# Altium schematic sheet MotherboardSupply.SchDoc: IMEBUILD V2 BP
size A4; Organization: Lightwave Lab; Address1: Princeton University; Address2: Princeton NJ 08544; Address3: United States; DocumentNumber: 3; Revision: B; SheetNumber: 3; SheetTotal: 3
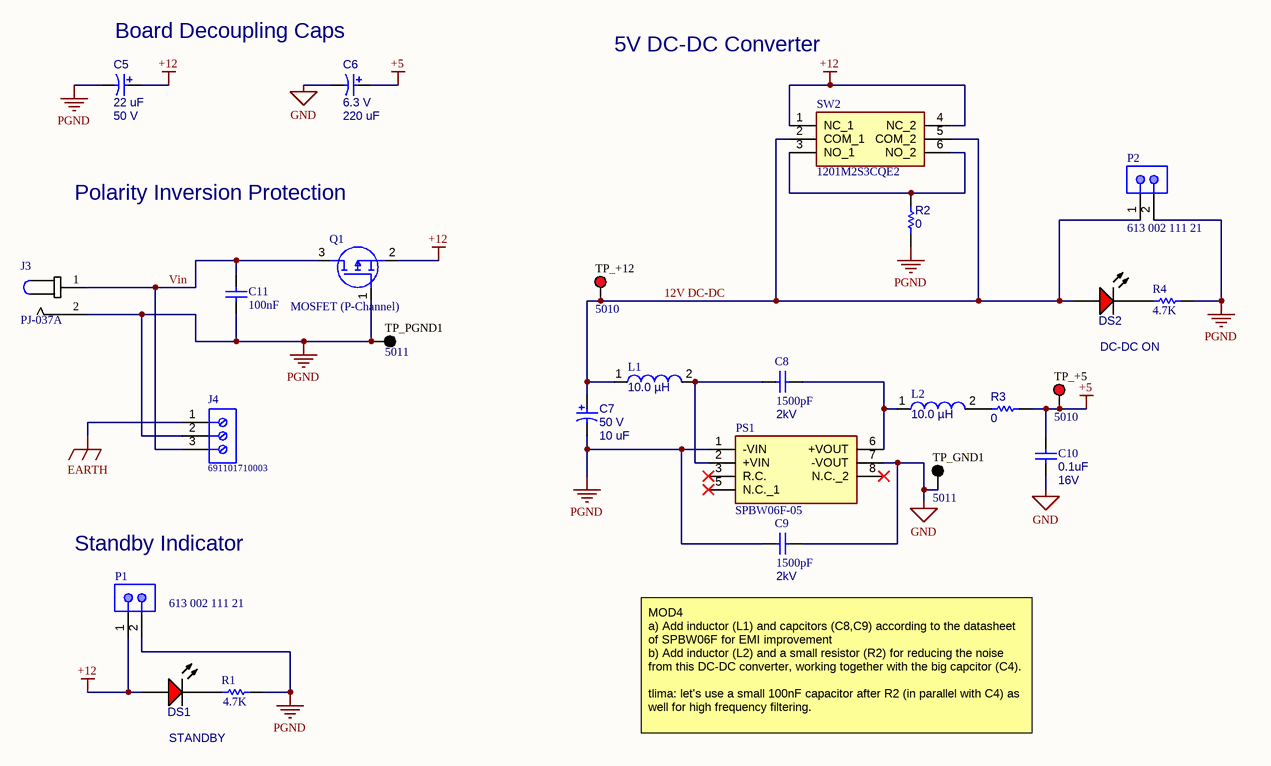
[diagram p0: MotherboardSupply.SchDoc]

## Parts
C5  Rated Capacitance: 22 uF  Rated Voltage: 50 V  [NIC-CAPA2-6.3X5.8_V]  (hidden comment: UUD1H220MCL1GS)
C6  Rated Voltage: 6.3 V  Rated Capacitance: 220 uF  [NIC-CAPA2-6.3X5.8_V]  (hidden comment: UUD0J221MCL1GS)
C7  Rated Voltage: 50 V  Rated Capacitance: 10 uF  [NIC-CAPA2-6.3X5.8_V]  (hidden comment: UUD0J221MCL1GS)
C8  value 1500pF  Rated Voltage: 2kV  [C1206]  (hidden comment: CC1206KKX7RDBB152)
C9  value 1500pF  Rated Voltage: 2kV  [C1206]  (hidden comment: CC1206KKX7RDBB152)
C10  value 0.1uF  Rated Voltage: 16V  [CAPC1608X87X35LL15T15]  (hidden comment: C0603C104K4RACTU)
C11  100nF  [CAPC1206(3216)150_M]
DS1  TLMS1000-GS08  [VISH-TLMS1000_V]  (value not drawn)
DS2  TLMS1000-GS08  [VISH-TLMS1000_V]  (value not drawn)
J3  PJ-037A  [*CUI_PJ-037A]
J4  691101710003  [691101710003]
L1  Inductance: 10.0 µH  [WE-PD-L]  (hidden comment: 74477110)
L2  Inductance: 10.0 µH  [WE-PD-L]  (hidden comment: 74477110)
P1  613 002 111 21  [WE-61300211121_V]
P2  613 002 111 21  [WE-61300211121_V]
PS1  SPBW06F-05  [SPBW06F05]
Q1  MOSFET (P-Channel)  [FFSB20120AF085]
R1  4.7K  [RESC3216X60X45ML10T20]
R2  0  [RESC3216X105X45ML10T20]
R3  0  [RESC3216X105X45ML10T20]
R4  4.7K  [RESC3216X60X45ML10T20]
SW2  1201M2S3CQE2  [1201M2S3CQE2]
TP_+5  5010  [KSTN-5010_V]
TP_+12  5010  [KSTN-5010_V]
TP_GND1  5011  [KSTN-5011_V]
TP_PGND1  5011  [KSTN-5011_V]

## Nets
+5: C6.1 C10.2 R3.2 TP_+5.1
+12: C5.1 DS1.1(A) P1.1 Q1.2(S) SW2.1(NC_1) SW2.4(NC_2)
EARTH: J4.1
GND: C6.2 C9.2 C10.1 PS1.7(-VOUT) TP_GND1.1
PGND: C5.2 C7.2 C9.1 C11.2 J3.2 J4.2 P1.2 P2.2 PS1.1(-VIN) Q1.1(G) R1.2 R2.2 R4.1 TP_PGND1.1
12V DC-DC: C7.1 DS2.1(A) L1.1 P2.1 SW2.2(COM_1) SW2.5(COM_2) TP_+12.1
Vin: C11.1 J3.1 J4.3 Q1.3(D)
NetC8_1: C8.1 L1.2 PS1.2(+VIN)
NetC8_2: C8.2 L2.1 PS1.6(+VOUT)
NetDS1_2: DS1.2(K) R1.1
NetDS2_2: DS2.2(K) R4.2
NetL2_2: L2.2 R3.1
NetR2_1: R2.1 SW2.3(NO_1) SW2.6(NO_2)

Not connected (* = marked no-connect by the designer): PS1 3(R.C.)* 5(N.C._1)* 8(N.C._2)*

## Notes on the sheet
- Board Decoupling Caps
- 5V DC-DC Converter
- Polarity Inversion Protection
- DC-DC ON
- Standby Indicator
- STANDBY
- MOD4
  a) Add inductor (L1) and capcitors (C8,C9) according to the datasheet of SPBW06F for EMI improvement
  b) Add inductor (L2) and a small resistor (R2) for reducing the noise from this DC-DC converter, working together with the big capcitor (C4).
  tlima: let's use a small 100nF capacitor after R2 (in parallel with C4) as well for high frequency filtering.
- Title
- Date:
- Size:
- A4
- Revision:
- File:
- Sheet
- /

## Library data of the parts
C5 = CMP-0687-00033-1: Aluminum Electrolytic Capacitor, UD Series, Low Impedance, 22 uF, 50 V, + / - 20%, -55 to 105 degC, Chip Type, 6.3 x 5.8 mm D x L, Pb-Free, Reel; Manufacturer: Nichicon; Impedance: 0.88 Ohm; Rated Ripple Current (at 100kHz): 165 mA; Tolerance Rated Capacitance: -20 to 20%; Endurance Time: 2000 h; Packing: Dia382mm Reel; PackageReference: CAPAE-D6.3H5.8; ComponentLink3Description: Package Specification; RoHS: TRUE; Diameter: 6.3 mm; ComponentLink1Description: Manufacturer URL; DatasheetVersion: 08/2012; Length: 5.8 mm; ComponentLink2URL: http://products.nichicon.co.jp/en/pdf/XJA043/e-ud.pdf; PartNumber: UUD1H220MCL1GS; Mounting Technology: Surface Mount; ComponentLink2Description: Datasheet; ComponentLink1URL: http://www.nichicon.co.jp/; ComponentLink3URL: http://products.nichicon.co.jp/en/pdf/XJA043/e-ud.pdf; PackageDescription: 2-Pin Surface Mount Device, Diameter 6.3 mm, Height 5.8 mm, Pitch 5.4 mm
C6 C7 = CMP-0687-00051-1: Aluminum Electrolytic Capacitor, UD Series, Low Impedance, 220 uF, 6.3 V, + / - 20%, -55 to 105 degC, Chip Type, 6.3 x 5.8 mm D x L, Pb-Free, Reel; Manufacturer: Nichicon; Endurance Time: 2000 h; Tolerance Rated Capacitance: -20 to 20%; Rated Ripple Current (at 100kHz): 230 mA; Impedance: 0.44 Ohm; Packing: Dia382mm Reel; RoHS: TRUE; ComponentLink3URL: http://products.nichicon.co.jp/en/pdf/XJA043/e-ud.pdf; ComponentLink2URL: http://products.nichicon.co.jp/en/pdf/XJA043/e-ud.pdf; ComponentLink3Description: Package Specification; PackageReference: CAPAE-D6.3H5.8; ComponentLink2Description: Datasheet; Length: 5.8 mm; PackageDescription: 2-Pin Surface Mount Device, Diameter 6.3 mm, Height 5.8 mm, Pitch 5.4 mm; Mounting Technology: Surface Mount; ComponentLink1URL: http://www.nichicon.co.jp/; DatasheetVersion: 08/2012; Diameter: 6.3 mm; ComponentLink1Description: Manufacturer URL; PartNumber: UUD0J221MCL1GS
C8 C9 = Cap Semi: Capacitor (Semiconductor SIM Model); Published: 8-Jun-2000; LatestRevisionDate: 29-May-2009; LatestRevisionNote: IPC-7351 Footprint Added.; PackageReference: C1206; Publisher: Altium Limited; PackageDescription: Chip Capacitor
C10 = CMP-2006-03058-1: Manufacturer: Kemet; Part Number: C0603C104K4RACTU
C11 = CMP-1037-04229-1: CAP 100nF 250V ±10% 1206 (3216 Metric) Thickness 1.45mm SMD; Case-EIA: 1206; Tolerance: Â±10%; Case-Metric: 3216; Technology: SMT; Rated Voltage: 250 V; Max Thickness: 1.45 mm; Value: 100nF
DS1 DS2 = CMP-2000-07254-1: Low Current LED, 40 mW, 1.8 V, -40 to 100 degC, 2-Pin SMD (0603), RoHS, Tape and Reel; Manufacturer: Vishay; Lens Shape: Rectangular; Automotive Qualification Standard: AEC-Q100; Wavelength Typ: 636nm; SVHC: ToBeAdvised; LED Colour: Red; Bulb Size: 1.6mmx0.8mm; Forward Voltage: 1.8V; Luminous Intensity: 4mcd; Forward Current If: 2mA; Viewing Angle: 80°; Datasheet Version: Rev. 1.7, 02/2011; Datasheet URL: https://datasheet.ciiva.com/5798/1698881-5798337.pdf; LED Mounting: SMD; Packaging: CutTape; Package Reference: TLMS1000; Manufacturer URL: http://www.vishay.com/; Mounting Technology: SurfaceMount; Product Range: -; Package Description: 2-Pin Surface Mount Device, Body 1.6 x 0.8 mm; MSL: MSL2-1year
J3 = PJ-037A: 2.0 x 6.5 mm, 2.5 A, Horizontal, Through Hole, Dc Power Jack Connector; MF: CUI Inc.; SnapEDA_Link: https://www.snapeda.com/parts/PJ-037A/CUI%20Inc./view-part/?ref=snap; MP: PJ-037A; Digi-Key_Purchase_URL: https://www.digikey.com/product-detail/en/cui-devices/PJ-037A/CP-037A-ND/1644545?utm_source=snapeda&utm_medium=aggregator&utm_campaign=symbol; Digi-Key_Part_Number: CP-037A-ND; Package: None; CUI_purchase_URL: https://www.cui.com/product/interconnect/connectors/dc-power-connectors/jacks/pj-037a?utm_source=snapeda.com&utm_medium=referral&utm_campaign=snapedaBOM; Value: *
J4 = CMP-1502-03257-1: Series 101 - 5.00 mm Horizontal Entry Modular with Pressure Clamp WR-TBL, 3 pin; Manufacturer: Wurth Elektronik; Pitch: 5.00mm; Pin Number: 3; Publisher: WurthElektronik; Part Number: 691101710003; Operating Temperature: -40to105degC; Package Reference: 691101710003; Packaging: Box; Manufacturer URL: http://www.we-online.de; Datasheet URL: http://katalog.we-online.de/em/datasheet/6911017100xx.pdf; Mounting Technology: THT
L1 L2 = CMP-0227-00708-1: SMD-Shielded Power Inductor WE-PD, L = 10.0 µH; ComponentLink2Description: Datasheet; DatasheetVersion: ver 7, Sep-2006; PackageVersion: 2006; ComponentLink1URL: http://www.we-online.com; ComponentLink1Description: Manufacturer Link; ComponentLink2URL: http://www.we-online.de/katalog/media/pdf/74477110.pdf; PackageDescription: SMD Inductor, 2-Leads, Body 12.0 x 12.0 mm; PackageReference: WE-PD-L
P1 P2 = CMP-1712-00002-3: Male Header, Pitch 2.54 mm, 1 x 2 Position, Height 8.54 mm, Tail Length 3 mm, -40 to 105 degC, RoHS, Bulk; Mounting Technology: Through Hole; Packaging: Bulk; Pins: 2; REACH SVHC: No SVHC; PartNumber: 613 002 111 21; PackageDescription: Male Header, Pitch 2.54 mm, 1 x 2 Position, Height 8.54 mm, Tail Length 3 mm; ComponentLink1Description: Manufacturer URL; Max Operating Temperature: 125 degC; ComponentLink1URL: https://www.we-online.com/; ComponentLink2Description: Datasheet; Mount: Through Hole; DatasheetVersion: Rev. J; Min Operating Temperature: -40 degC; ComponentLink2URL: http://katalog.we-online.de/em/datasheet/6130xx11121.pdf; RoHSCompliant: True
PS1 = SPBW06F-05: Power Supply; Manufacturer_Name: Mean Well; Allied_Number: 71028194; Datasheet Link: http://www.meanwellusa.com/productPdf.aspx?i=795; Height: 11.6mm; Manufacturer_Part_Number: SPBW06F-05; Mouser Part Number: 709-SPBW06F-05; Mouser Price/Stock: https://www.mouser.com/Search/Refine.aspx?Keyword=709-SPBW06F-05; Allied Price/Stock: https://www.alliedelec.com/mean-well-usa-spbw06f-05/71028194/
Q1 = FQB47P06TM-AM002: Manufacturer_Name: Fairchild Semiconductor; Datasheet Link: https://www.onsemi.com/pub/Collateral/FQB47P06-D.PDF; Manufacturer_Part_Number: FQB47P06TM-AM002; Mouser Part Number: 512-FQB47P06TM_AM002; Mouser Price/Stock: https://www.mouser.com/Search/Refine.aspx?Keyword=512-FQB47P06TM_AM002
R1 R4 = CMP-2003-02467-1: CRCW12064K70JNEB; Manufacturer: Vishay Dale; Part Number: CRCW12064K70JNEB
R2 R3 = CMP-2003-04857-1: CRCW12060000Z0EA; Manufacturer: Vishay Dale; Part Number: CRCW12060000Z0EA
SW2 = 1201M2S3CQE2: Switch; Manufacturer_Name: C&K Switches; Allied_Number: 70269986; Datasheet Link: https://www.ckswitches.com/media/1429/1000.pdf; Height: 11.43mm; Manufacturer_Part_Number: 1201M2S3CQE2; Mouser Part Number: 611-1201M2S3CQE2; Allied Price/Stock: https://www.alliedelec.com/c-k-1201m2s3cqe2/70269986/
TP_+5 TP_+12 = CMP-1672-00002-4: Test Point, Red, Through Hole, RoHS, Bulk; Manufacturer: Keystone; Contact Material: Bronze; Mounting Technology: Through Hole; RoHSCompliant: true; Pins: 1; Package Quantity: 100; ComponentLink2Description: Datasheet; Height: 8.12 mm; ComponentLink1URL: http://www.keyelco.com/; DatasheetVersion: Rev. F, 12/2013; Mount: Through Hole; PackageReference: 5010; Contact Plating: Silver; Packaging: Bulk; Colour: Red; REACH SVHC: No SVHC; PackageDescription: 1-Pin Through Hole Device, Dia 3.17 mm; ComponentLink2URL: http://www.keyelco.com/product-pdf.cfm?p=1319; ComponentLink1Description: Manufacturer URL
TP_GND1 TP_PGND1 = CMP-1672-00003-4: Test Point, Black, Through Hole, RoHS, Bulk; Manufacturer: Keystone; ComponentLink2URL: http://www.keyelco.com/product-pdf.cfm?p=1320; Colour: Black; Pins: 1; REACH SVHC: No SVHC; ComponentLink1URL: http://www.keyelco.com/; PackageReference: 5011; Contact Plating: Silver; Package Quantity: 100; Packaging: Bulk; RoHSCompliant: true; Height: 8.12 mm; PackageDescription: 1-Pin Through Hole Device, Dia 3.17 mm; Mount: Through Hole; Mounting Technology: Through Hole; DatasheetVersion: Rev. F, 12/2013; ComponentLink1Description: Manufacturer URL; Contact Material: Bronze; ComponentLink2Description: Datasheet